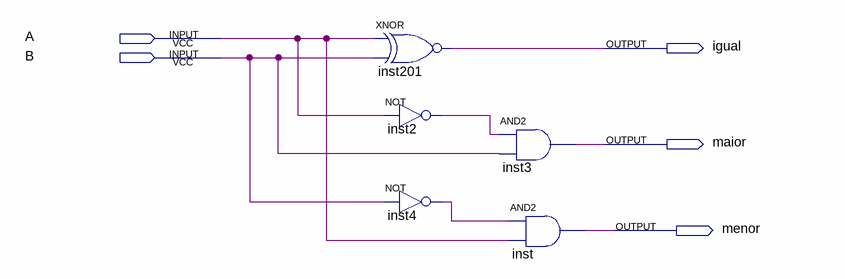
[diagram p0: schematic sheet]
// Quartus schematic comparador_sinal.bdf as structural Verilog: 5 symbols, 5 pins
module comparador_sinal (
  input  A,
  input  B,
  output igual,
  output maior,
  output menor
);

  wire inst2_out, inst4_out;

  xnor inst201 (igual, A, B);
  not inst2 (inst2_out, A);
  not inst4 (inst4_out, B);
  and inst3 (maior, inst2_out, B);
  and inst (menor, inst4_out, A);
endmodule
